# EAGLE design CAP1203 (EAGLE 9.3.0)
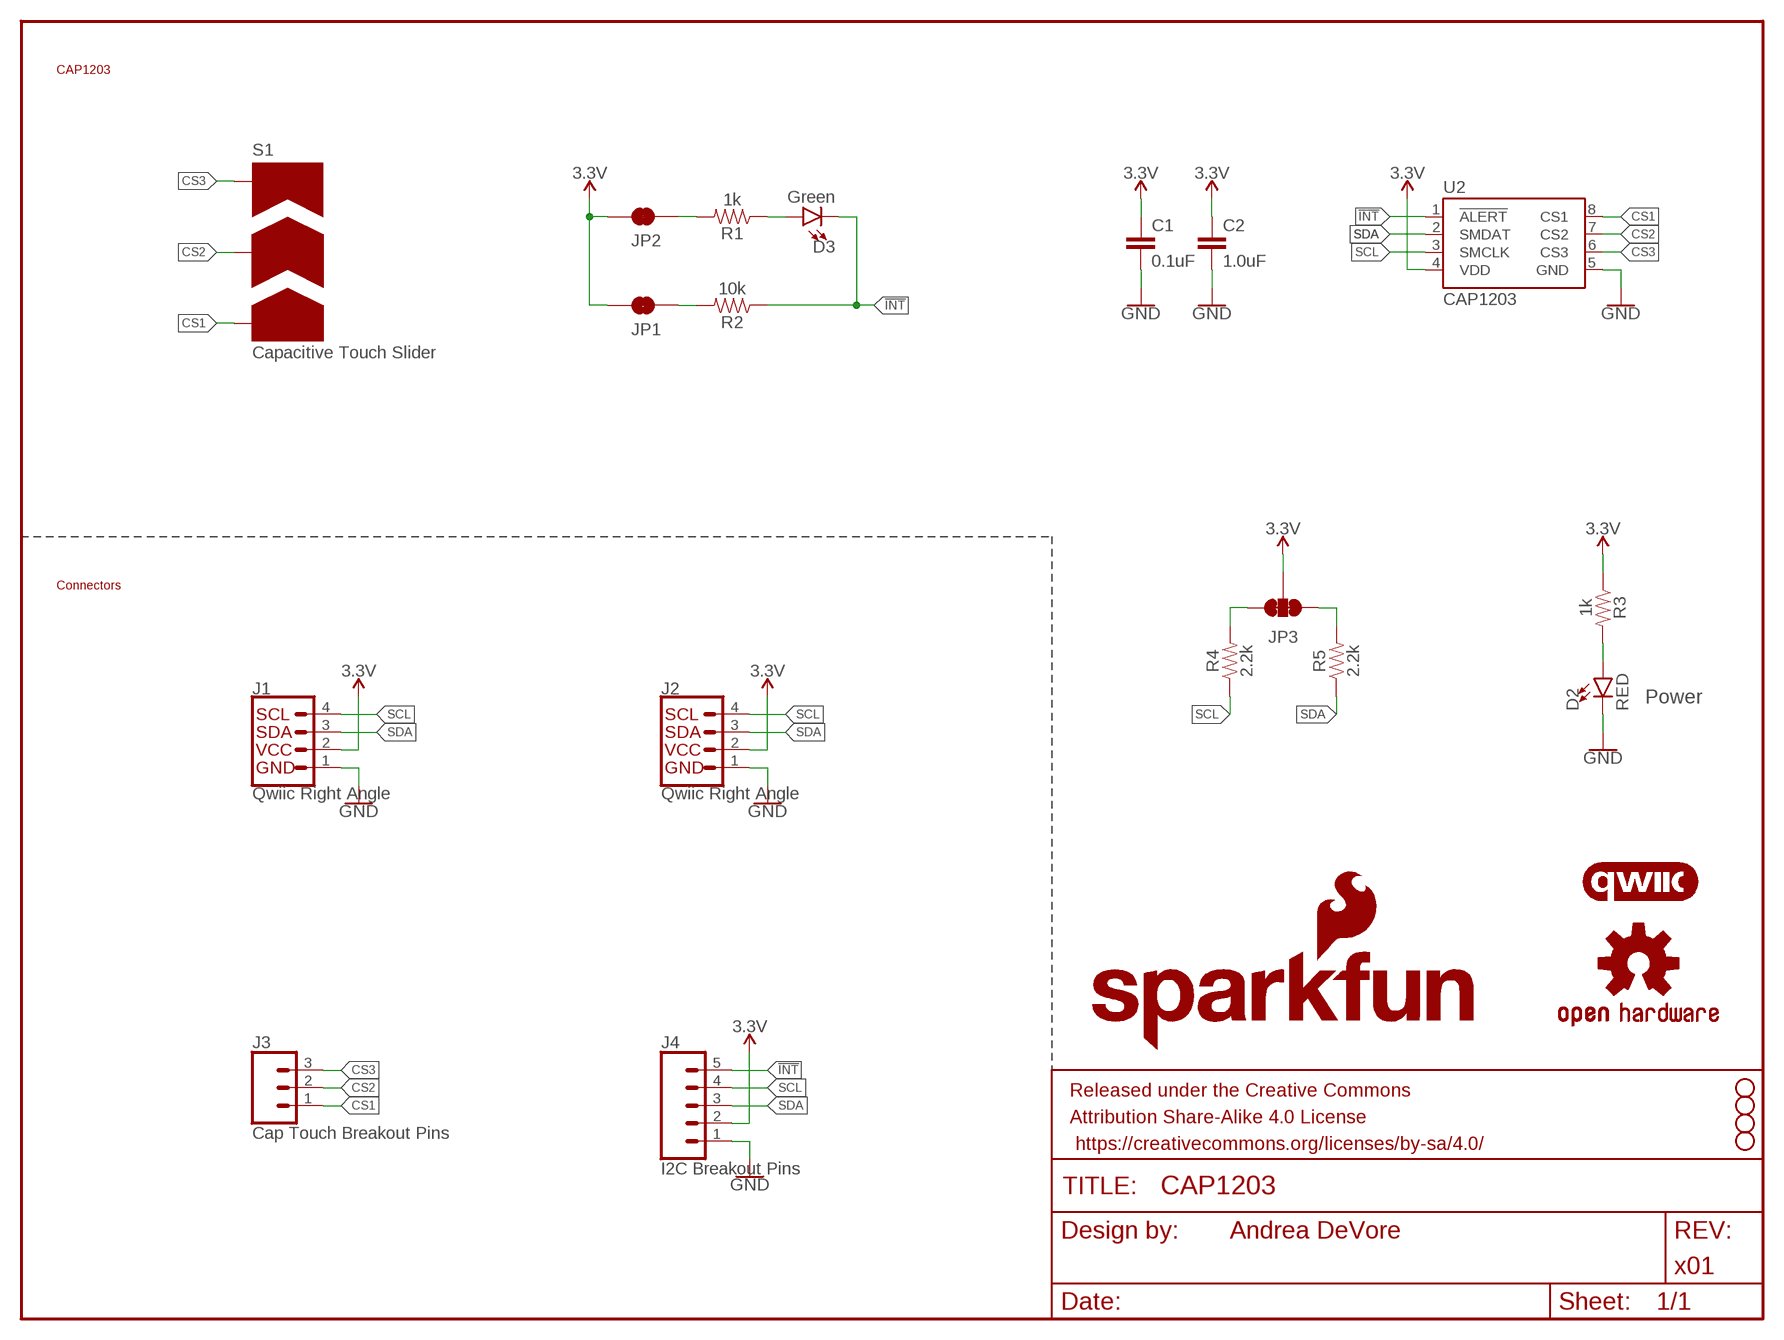
[diagram p0: schematic, sheet 1]

## Parts
C1  0.1uF  0.1UF-0603-25V-5%  [0603]
C2  1.0uF  1.0UF-0603-16V-10%  [0603]
D2  RED  LED-RED0603  [LED-0603]
D3  Green  LED-GREEN1206-BOTTOM  [LED-1206-BOTTOM]
FRAME1  FRAME-LETTER  [CREATIVE_COMMONS]
H1  STAND-OFF  [STAND-OFF]
H2  STAND-OFF  [STAND-OFF]
H3  STAND-OFF  [STAND-OFF]
H5  STAND-OFF  [STAND-OFF]
J1  Qwiic Right Angle  I2C_STANDARDQWIIC  [JST04_1MM_RA]
J2  Qwiic Right Angle  I2C_STANDARDQWIIC  [JST04_1MM_RA]
J3  Cap Touch Breakout Pins  CONN_031X03_NO_SILK  [1X03_NO_SILK]
J4  I2C Breakout Pins  CONN_05NO_SILK  [1X05_NO_SILK]
JP1  JUMPER-SMT_2_NC_TRACE_SILK  [SMT-JUMPER_2_NC_TRACE_SILK]
JP2  JUMPER-SMT_2_NC_TRACE_SILK  [SMT-JUMPER_2_NC_TRACE_SILK]
JP3  JUMPER-SMT_3_2-NC_TRACE_SILK  [SMT-JUMPER_3_2-NC_TRACE_SILK]
LOGO1  SFE_LOGO_NAME_FLAME.1_INCH  [SFE_LOGO_NAME_FLAME_.1]
LOGO3  OSHW-LOGOS  [OSHW-LOGO-S]
R1  1k  1KOHM-0603-1/10W-1%  [0603]
R2  10k  10KOHM-0603-1/10W-1%  [0603]
R3  1k  1KOHM-0603-1/10W-1%  [0603]
R4  2.2k  2.2KOHM-0603-1/10W-1%  [0603]
R5  2.2k  2.2KOHM-0603-1/10W-1%  [0603]
S1  CAP_SENSE_SLIDER  [CAP_SENSE_SLIDER]
U2  CAP1203  [SO08-TIGHT]
U$17  QWIIC_LOGO_5MM  [QWIIC_5MM]

## Nets
3.3V [VCC]: C1.1 C2.1 J1.2 J2.2 J4.2 JP1.2 JP2.2 JP3.2 R3.1 U2.4(VDD)
!INT: D3.C J4.5 R2.1 U2.1(!ALERT)
CS1: J3.1 S1.1 U2.8(CS1)
CS2: J3.2 S1.2 U2.7(CS2)
CS3: J3.3 S1.3 U2.6(CS3)
GND: C1.2 C2.2 D2.C J1.1 J2.1 J4.1 U2.5(GND)
N$1: JP1.1 R2.2
N$2: D2.A R3.2
N$3: JP2.1 R1.2
N$4: JP3.3 R4.2
N$5: JP3.1 R5.2
N$6: D3.A R1.1
SCL: J1.4 J2.4 J4.4 R4.1 U2.3(SMCLK)
SDA: J1.3 J2.3 J4.3 R5.1 U2.2(SMDAT)

## Notes on the sheet
- CAP1203
- Capacitive Touch Slider
- Connectors
- Power
- Andrea DeVore
- x01

## Library data of the parts
C1 = SparkFun-Capacitors:0.1UF: 0.1µF ceramic capacitors A capacitor is a passive two-terminal electrical component used to store electrical energy temporarily in an electric field.; PROD_ID: CAP-08604
C2 = SparkFun-Capacitors:1.0UF: 1µF ceramic capacitors A capacitor is a passive two-terminal electrical component used to store electrical energy temporarily in an electric field.; PROD_ID: CAP-00868
D2 = SparkFun-LED:LED-RED: Red SMD LED Used in manufacturing of most products at SparkFun Packages: 0603 - SMD 0603 package [Product Link] <http://docs.avagotech.com/docs/AV02-0551EN> 0603 SMART - SMD 0603 SMART package ( more efficient and expensive)[Product Link] <http://www.osram-os.com/Graphics/XPic2/00077099_0.pdf> 1206 - SMD1206 package [Product Link] <https://www.sparkfun.com/datasheets/DevTools/LilyPad/Q150OVS4.pdff> SparkFun Products: Pro Mini 328 -5V <https://www.sparkfun.com/products/821> RedBoard <https://www.sparkfun.com/products/12757> IOIO-OTG <https://www.sparkfun.com/products/13613>; PROD_ID: DIO-00819
D3 = SparkFun-LED:LED-GREEN: Green SMD LED Used in manufacturing of various products at SparkFun Packages: 0603 - SMD 0603 package [Product Link] <http://www.futureelectronics.com/en/technologies/semiconductors/optoelectronics/leds/Pages/9894312-LTST-C190GKT.aspx?CrossPart=HSMG-C190&IM=0> LilyPad 1206 - SMD1206 LilyPad package [Product Link] <http://www.futureelectronics.com/en/Technologies/Product.aspx?ProductID=IN150NGHARVATEKCORPORATION2049943&IM=0> 1206 - SMD1206 package [Product Link] <http://www.futureelectronics.com/en/technologies/semiconductors/optoelectronics/leds/Pages/8315665-LTST-C150KGKT.aspx?IM=0> 1206 Bottom Mount -SMD 1206 Bottom Mount [Product Link] <http://www.digikey.com/product-detail/en/lite-on-inc/LTST-C230KGKT/160-1456-1-ND/386854> SparkFun Products: Pro Mini 328 -5V <https://www.sparkfun.com/products/821> RedBoard <https://www.sparkfun.com/products/12757> MP3 Trigger <https://www.sparkfun.com/products/13720> Makey Makey <https://www.sparkfun.com/products/11076>; PROD_ID: DIO-11076
FRAME1 = SparkFun-Aesthetics:FRAME-LETTER: Schematic Frame - Letter Standard 8.5x11 US Letter frame
H1-H3 H5 = SparkFun-Hardware:STAND-OFF: Stand Off Drill holes for mechanically mounting via screws, standoffs, etc. Note: Use the keepout ring to avoid running the screw head into surrounding components. Variant Overviews STAND-OFF - Mechanical footprint for a #4 phillips button head screw. STAND-OFF-TIGHT - Mechanical footprint for a #4 phillips button head screw, Example SparkFun Products Screw - Phillips Head (1/4", 4-40, 10 pack) <https://www.sparkfun.com/products/10453> (PRT-10453) Screw - Phillips Head (1/2", 4-40, 10 pack) <https://www.sparkfun.com/products/10452> (PRT-10452) Screw - Phillips Head (3/4", 4-40, 10 pack) <https://www.sparkfun.com/products/10451> (PRT-10451) Screw - Phillips Head (1", 4-40, 10 pack) <https://www.sparkfun.com/products/10450> (PRT-10450)
J1 J2 = SparkFun-Connectors:I2C_STANDARD: SparkFun I2C Standard Pinout Header SparkFun has standardized on a pinout for all I2C based sensor breakouts. This pinout allows I2C boards to be plugged directly into the headers on Arduino Uno compatible boards, and to be daisy chained easily. Example SparkFun Products: SparkFun Atmospheric Sensor Breakout - BME280 <https://www.sparkfun.com/products/13676> SparkFun Altitude/Pressure Sensor Breakout - MPL3115A2 <https://www.sparkfun.com/products/11084> SparkFun TOF Range Finder Sensor - VL6180 <https://www.sparkfun.com/products/12785>; PROD_ID: CONN-13694
J3 = SparkFun-Connectors:CONN_03: Multi connection point. Often used as Generic Header-pin footprint for 0.1 inch spaced/style header connections On any of the 0.1 inch spaced packages, you can populate with these: Break Away Headers - Straight <https://www.sparkfun.com/products/116> (PRT-00116) Break Away Male Headers - Right Angle <https://www.sparkfun.com/products/553> (PRT-00553) Female Headers <https://www.sparkfun.com/products/115> (PRT-00115) Break Away Headers - Machine Pin <https://www.sparkfun.com/products/117> (PRT-00117) Break Away Female Headers - Swiss Machine Pin <https://www.sparkfun.com/products/743> (PRT-00743) Stackable Header - 3 Pin (Female, 0.1") <https://www.sparkfun.com/products/13875> (PRT-13875) For SCREWTERMINALS and SPRING TERMINALS visit here: Screw Terimnals on SparkFun.com <https://www.sparkfun.com/search/results?term=Screw+Terminals> (5mm/3.5mm/2.54mm spacing) This device is also useful as a general connection point to wire up your design to another part of your project. Our various solder wires solder well into these plated through hole pads. Hook-Up Wire - Assortment (Stranded, 22 AWG) <https://www.sparkfun.com/products/11375> (PRT-11375) Hook-Up Wire - Assortment (Solid Core, 22 AWG) <https://www.sparkfun.com/products/11367> (PRT-11367) View the entire wire category on our website here <https://www.sparkfun.com/categories/141> Special notes: Molex polarized connector foot print use with SKU : PRT-08232 with associated crimp pins and housings.
J4 = SparkFun-Connectors:CONN_05: Multi connection point. Often used as Generic Header-pin footprint for 0.1 inch spaced/style header connections On any of the 0.1 inch spaced packages, you can populate with these: Break Away Headers - Straight <https://www.sparkfun.com/products/116> (PRT-00116) Break Away Male Headers - Right Angle <https://www.sparkfun.com/products/553> (PRT-00553) Female Headers <https://www.sparkfun.com/products/115> (PRT-00115) Break Away Headers - Machine Pin <https://www.sparkfun.com/products/117> (PRT-00117) Break Away Female Headers - Swiss Machine Pin <https://www.sparkfun.com/products/743> (PRT-00743) For SCREWTERMINALS and SPRING TERMINALS visit here: Screw Terimnals on SparkFun.com <https://www.sparkfun.com/search/results?term=Screw+Terminals> (5mm/3.5mm/2.54mm spacing) This device is also useful as a general connection point to wire up your design to another part of your project. Our various solder wires solder well into these plated through hole pads. Hook-Up Wire - Assortment (Stranded, 22 AWG) <https://www.sparkfun.com/products/11375> (PRT-11375) Hook-Up Wire - Assortment (Solid Core, 22 AWG) <https://www.sparkfun.com/products/11367> (PRT-11367) View the entire wire category on our website here <https://www.sparkfun.com/categories/141> Special notes: Molex polarized connector foot print use with SKU : PRT-08231 with associated crimp pins and housings. 1MM SMD Version SKU: PRT-10208
JP1 JP2 = SparkFun-Jumpers:JUMPER-SMT_2_NC_TRACE: Normally closed trace jumper This jumper has a trace between two pads so it's normally closed (NC). Use a razor knife to open the connection. For best results follow the IPC guidelines for cutting traces: Cutout at least 0.063 mm (0.005 in). Remove all loose material to clean up the cut area. Seal the cut with an approved epoxy. Reapply solder to reclose the connection.
JP3 = SparkFun-Jumpers:JUMPER-SMT_3_2-NC_TRACE: Normally closed trace jumper (2 of 2 connections) This jumper has a trace between all three pads so they are normally closed (NC). Use a razor knife to open the connection(s). For best results follow the IPC guidelines for cutting traces: Cutout at least 0.063 mm (0.005 in). Remove all loose material to clean up the cut area. Seal the cut with an approved epoxy. Reapply solder to reclose the connection(s).
LOGO1 = SparkFun-Aesthetics:SFE_LOGO_NAME_FLAME: SparkFun Font Logo w/ Flame This is the SparkFun full logo. The logo on the schematic will always be the same size; the package variant is the height of the flame part of the logo. Default layer for the logo on the board is tSilk.
LOGO3 = SparkFun-Aesthetics:OSHW-LOGO: Open-Source Hardware (OSHW) Logo This logo indicates the piece of hardware it is found on incorporates a OSHW license and/or adheres to the definition of open source hardware found here: http://freedomdefined.org/OSHW
R1 R3 = SparkFun-Resistors:1KOHM: 1kΩ resistor A resistor is a passive two-terminal electrical component that implements electrical resistance as a circuit element. Resistors act to reduce current flow, and, at the same time, act to lower voltage levels within circuits. - Wikipedia; PROD_ID: RES-07856
R2 = SparkFun-Resistors:10KOHM: 10kΩ resistor A resistor is a passive two-terminal electrical component that implements electrical resistance as a circuit element. Resistors act to reduce current flow, and, at the same time, act to lower voltage levels within circuits. - Wikipedia; PROD_ID: RES-00824
R4 R5 = SparkFun-Resistors:2.2KOHM: 2.2kΩ resistor A resistor is a passive two-terminal electrical component that implements electrical resistance as a circuit element. Resistors act to reduce current flow, and, at the same time, act to lower voltage levels within circuits. - Wikipedia; PROD_ID: RES-08272
S1 = SparkX:CAP_SENSE_SLIDER
U2 = SparkFun-Sensors:CAP1203: CAP1203 Sensor A 3 channel, I2C based capacitive touch sensor; PROD_ID: IC-14356
U$17 = SparkFun-Aesthetics:QWIIC_LOGO: Qwiic Logos for placement on schematic and PCB. The 5.5mm silk logo is best for placing next to Qwiic connector.

## Net classes
1 VCC: width 0.305 mm

## Board
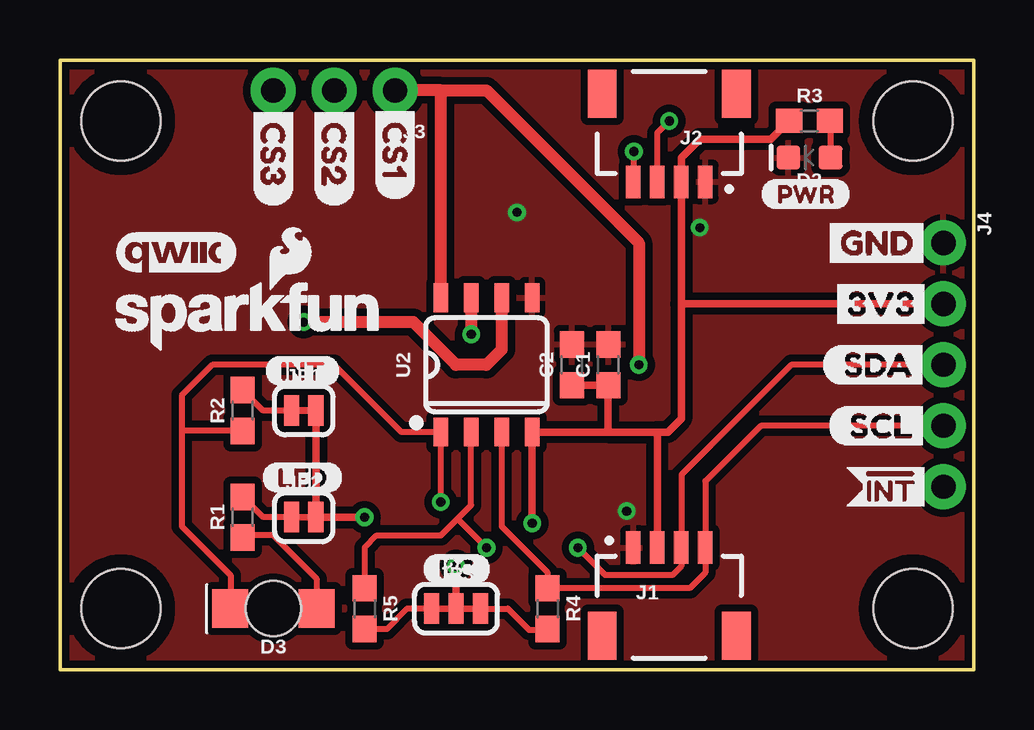
[diagram p1: board, top side]
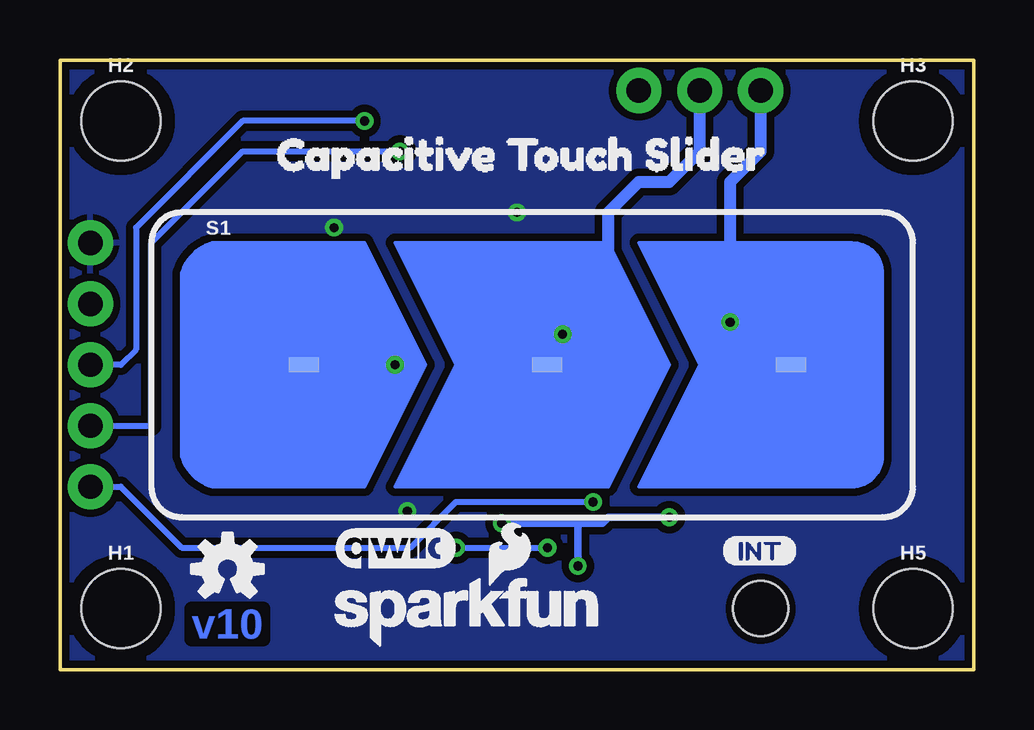
[diagram p2: board, bottom side, seen from below]

Size 38.1 x 25.4 mm. Coordinates in mm from the lower left corner, seen from the top.
Outline: 38.1,0 38.1,25.4 0,25.4 0,0 38.1,0
Copper layers (1*16): Top 0.035mm / dielectric 1.5mm / Bottom 0.035mm
Design rules "SparkFun-2-layer-TIGHT": minimum track width 7mil, minimum drill 15mil, track to track 7mil, track to pad 7mil, pad to pad 7mil, via to via 7mil, smd to smd 7mil, copper to edge 7mil, drill to drill 7mil, minimum pad ring 7mil, minimum via ring 7mil, stop-mask expansion 4mil, vias tented up to drill 25mil, thermal gap 10mil

### Footprints (pad centres in the part's own frame; a part is rotated, then mirrored left to right if it is on the bottom)
0603 = smd 1.1 x 1: 1 -0.85,0; 2 0.85,0
LED-0603 = smd 1 x 1: A -0.877,0; C 0.877,0
LED-1206-BOTTOM = smd 1.5 x 1.6: A -1.8,0; C 1.8,0 | hole 2.3: 0,0
STAND-OFF = hole 3.302: 0,0
JST04_1MM_RA = smd 0.6 x 1.35: 1 -1.5,0; 2 -0.5,0; 3 0.5,0; 4 1.5,0 | smd 1.2 x 2: NC1 2.8,-3.675; NC2 -2.8,-3.675
1X03_NO_SILK = drill 1.016 pad 1.88: 1 0,0; 2 2.54,0; 3 5.08,0
1X05_NO_SILK = drill 1.016 pad 1.88: 1 0,0; 2 2.54,0; 3 5.08,0; 4 7.62,0; 5 10.16,0
SMT-JUMPER_2_NC_TRACE_SILK = smd 0.635 x 1.27: 1 -0.508,0; 2 0.508,0
SMT-JUMPER_3_2-NC_TRACE_SILK = smd 0.635 x 1.27: 1 -1.016,0; 2 0,0; 3 1.016,0
CAP_SENSE_SLIDER = smd 1.27 x 0.635: 1 -10.16,0; 2 0,0; 3 10.16,0
SO08-TIGHT = smd 0.6 x 1.2: 1 -1.905,-2.8; 2 -0.635,-2.8; 3 0.635,-2.8; 4 1.905,-2.8; 5 1.905,2.8; 6 0.635,2.8; 7 -0.635,2.8; 8 -1.905,2.8

### Placement (x,y rotation side)
C1  22.86,12.7 90 top
C2  21.34,12.7 90 top
D2  31.24,21.34 180 top
D3  8.89,2.54 180 top
FRAME1  -5.08,-17.78 0 top  (outside the outline)
H1  35.56,2.54 0 bottom
H2  35.56,22.86 0 bottom
H3  2.54,22.86 0 bottom
H5  2.54,2.54 0 bottom
J1  25.4,5.08 0 top
J2  25.4,20.32 180 top
J3  13.97,24.13 180 top
J4  36.83,17.78 270 top
JP1  10.16,10.79 0 top
JP2  10.16,6.35 0 top
JP3  16.51,2.54 0 top
LOGO1  7.87,14.73 0 top
LOGO2  SFE_LOGO_NAME_FLAME.1_INCH  [SFE_LOGO_NAME_FLAME_.1]  21.08,2.41 0 bottom
LOGO3  31.11,4.19 0 bottom
R1  7.62,6.35 90 top
R2  7.62,10.79 90 top
R3  31.24,22.86 0 top
R4  20.32,2.54 270 top
R5  12.7,2.54 270 top
S1  17.78,12.7 0 bottom
U2  17.78,12.7 0 top
U$1  [3V3-04]  31.88,15.24 0 top
U$2  [GND-04]  31.62,17.78 0 top
U$4  QWIIC_LOGO_5MM  [QWIIC_5MM]  24.13,5.08 0 bottom
U$5  [INT0]  10.54,4.95 0 bottom
U$7  [#INT5]  32.51,7.62 0 top
U$8  [SCL3]  32,10.16 0 top
U$9  [SDA4]  31.75,12.7 0 top
U$10  [CS10]  13.97,23.75 270 top
U$11  [CS21]  11.43,23.75 270 top
U$12  [CS32]  8.89,23.75 270 top
U$13  [I_SUPER2_C-()-03]  15.11,4.19 0 top
U$14  [INT0]  8.51,12.45 0 top
U$15  [PWR-()-03]  29.21,19.81 0 top
U$16  [LED0]  8.38,8 0 top
U$17  4.83,17.4 0 top
U$18  [CAPACITIVE_TOUCH_SLIDER0]  30.23,21.46 0 bottom

### Tracks (layer width: path | path; a pad name or v marks a point on that pad's centre or on a via)
3.3V  (via drill 0.38)
  Top 0.305: JP1.2 JP2.2 v12.7,6.35 | v16.51,4.32 JP3.2 | v19.68,6.1 U2.4 22.85,9.9 | 25.9,15.24 J2.2 25.9,21.33 26.67,22.1 29.63,22.1 R3.1 | 25.9,15.24 25.9,10.46 25.34,9.9 24.89,9.9 | C2.1 C1.1 22.85,9.9 | 22.85,9.9 24.89,9.9 | 24.89,9.9 24.9,9.89 J1.2 | J4.2 25.9,15.24
  Bottom 0.305: v12.7,6.35 15.24,6.35 15.49,6.1 16.51,6.1 | v19.68,6.1 16.51,6.1 | 16.51,6.1 v16.51,4.32
!INT  (via drill 0.38)
  Top 0.254: v15.88,6.99 U2.1 14.23,9.9 11.43,12.7 6.35,12.7 5.08,11.43 5.08,9.95 | D3.C 7.11,2.56 7.11,3.94 5.08,5.97 5.08,9.95 | R2.1 5.08,9.95
  Bottom 0.254: J4.5 35.56,7.62 33.02,5.08 23.5,5.08 21.59,6.99 v15.88,6.99
CS1  (via drill 0.38)
  Top 0.508: v24.13,12.7 24.13,17.78 17.78,24.13 15.88,24.13 | U2.8 15.88,24.13 | 15.88,24.13 J3.1
  Bottom 0.508: S1.1 v24.13,12.7
CS2  (via drill 0.38)
  Top 0.508: U2.7 v17.14,13.97
  Bottom 0.508: S1.2 17.14,13.34 v17.14,13.97 15.24,15.88 15.24,19.05 13.97,20.32 12.7,20.32 11.43,21.59 J3.2
CS3  (via drill 0.38)
  Top 0.508: v10.16,14.48 14.73,14.48 16.51,12.7 17.78,12.7 18.41,13.34 U2.6
  Bottom 0.508: S1.3 9.4,14.48 v10.16,14.48 10.16,20.32 8.89,21.59 J3.3
GND  (via drill 0.38)
  other vias: 26.67,18.41 19.05,19.05 23.62,6.6
  pour Top (isolate 0.305): 38.1,25.4 38.1,0 0,0 0,25.4
  pour Bottom (isolate 0.305): 38.1,25.4 38.1,0 0,0 0,25.4
N$1
  Top 0.254: R2.2 8.47,10.79 JP1.1
N$2
  Top 0.254: R3.2 32.12,22.83 D2.A
N$3
  Top 0.254: JP2.1 8.47,6.35 R1.2
N$4
  Top 0.254: JP3.3 18.67,2.54 19.56,1.65 20.28,1.65 R4.2
N$5
  Top 0.254: JP3.1 14.48,2.54 13.63,1.69 R5.2
N$6
  Top 0.254: D3.A 10.69,3.79 8.89,5.59 7.71,5.59 R1.1
SCL  (via drill 0.38)
  Top 0.254: J4.4 29.21,10.16 26.9,7.85 J1.4 26.9,4.04 26.25,3.39 R4.1 20.32,4.06 18.41,5.97 U2.3 | v23.93,21.59 23.9,21.56 J2.4
  Bottom 0.254: J4.4 34.29,10.16 34.29,17.78 30.48,21.59 v23.93,21.59
SDA  (via drill 0.38)
  Top 0.254: J2.3 24.9,22.36 v25.4,22.86 | 16.57,6.29 15.88,5.59 13.21,5.59 12.7,5.08 R5.1 | 16.57,6.29 17.14,6.86 U2.2 | v17.78,5.08 16.57,6.29 | v21.59,5.08 22.73,3.94 25.53,3.94 25.9,4.31 J1.3 25.91,8.13 30.48,12.7 J4.3
  Bottom 0.254: v25.4,22.86 30.48,22.86 34.92,18.41 34.92,13.34 35.56,12.7 J4.3 | v21.59,5.08 v17.78,5.08

### Text on the board
Bottom: v10
tDocu: Andrea DeVore